# EAGLE design NEW LINE 十字左右 (EAGLE 9.6.2)

## Sheet 1 of 4

## Sheet 2 of 4
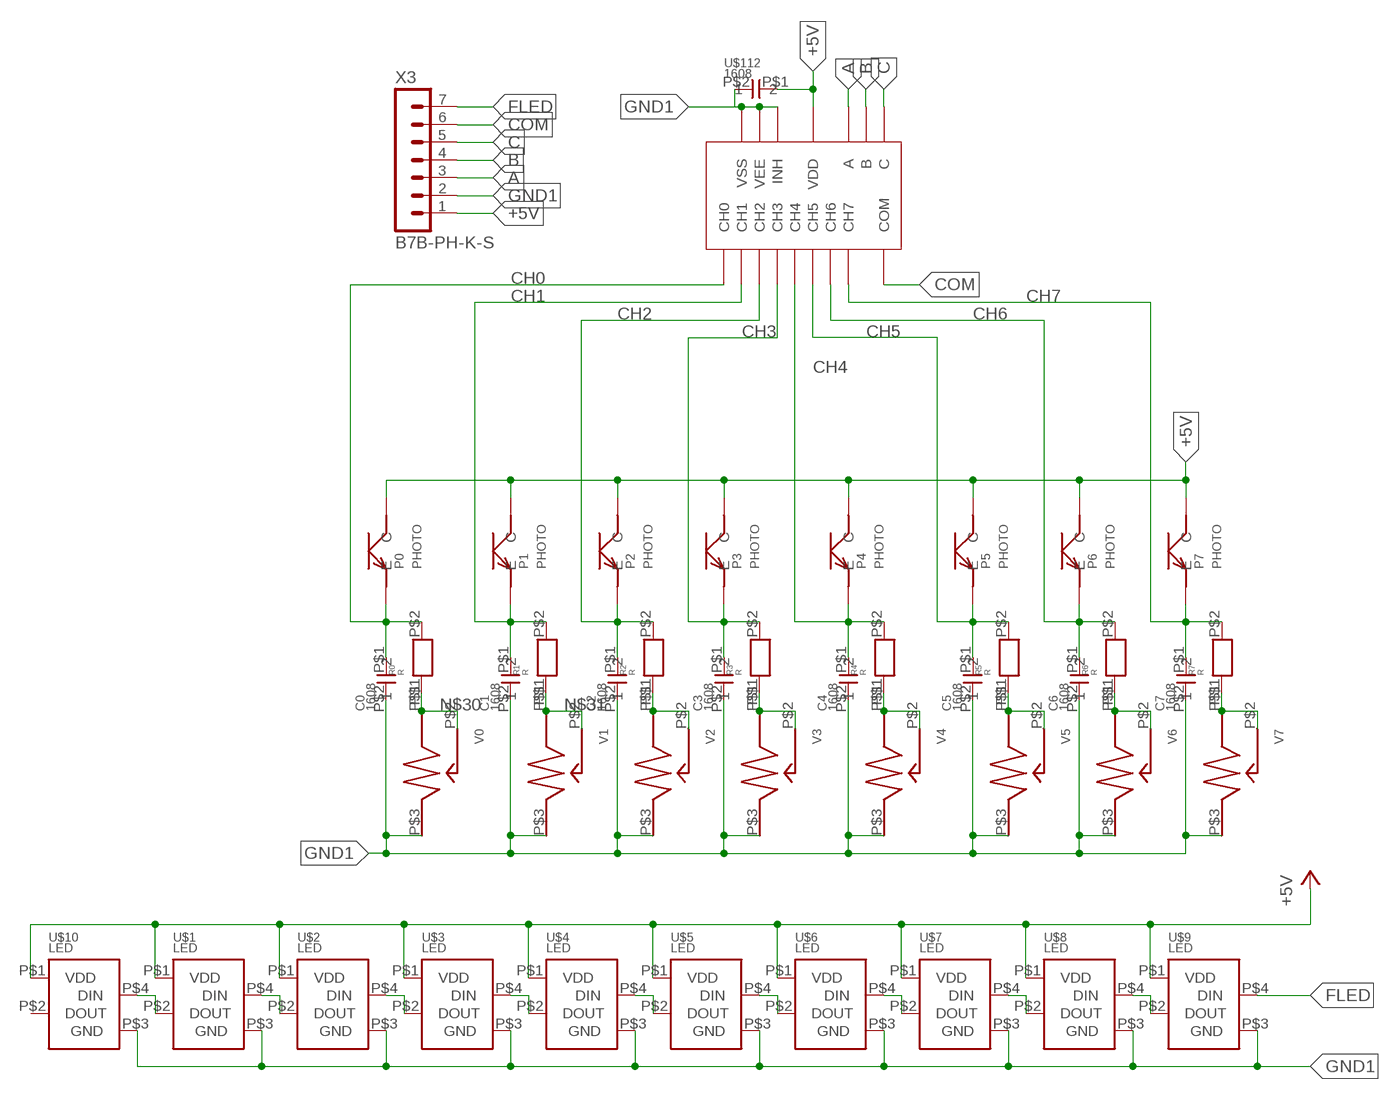
[diagram p0: schematic, sheet 2]

### Parts
C0  1608  [CON]
C1  1608  [CON]
C2  1608  [CON]
C3  1608  [CON]
C4  1608  [CON]
C5  1608  [CON]
C6  1608  [CON]
C7  1608  [CON]
P0  PHOTO  [PHOTO]
P1  PHOTO  [PHOTO]
P2  PHOTO  [PHOTO]
P3  PHOTO  [PHOTO]
P4  PHOTO  [PHOTO]
P5  PHOTO  [PHOTO]
P6  PHOTO  [PHOTO]
P7  PHOTO  [PHOTO]
R0  R  [1608]
R1  R  [1608]
R2  R  [1608]
R3  R  [1608]
R4  R  [1608]
R5  R  [1608]
R6  R  [1608]
R7  R  [1608]
U$1  LED  [LED]
U$2  LED  [LED]
U$3  LED  [LED]
U$4  LED  [LED]
U$5  LED  [LED]
U$6  LED  [LED]
U$7  LED  [LED]
U$8  LED  [LED]
U$9  LED  [LED]
U$10  LED  [LED]
U$79  AM  [SOP65P640X120-16N]
U$112  1608  [CON]
V0  VR  [VR]
V1  VR  [VR]
V2  VR  [VR]
V3  VR  [VR]
V4  VR  [VR]
V5  VR  [VR]
V6  VR  [VR]
V7  VR  [VR]
X3  B7B-PH-K-S  [B7B-PH-K-S]

### Nets
+5V: P0.P$1(C) P1.P$1(C) P2.P$1(C) P3.P$1(C) P4.P$1(C) P5.P$1(C) P6.P$1(C) P7.P$1(C) U$1.P$1(VDD) U$2.P$1(VDD) U$3.P$1(VDD) U$4.P$1(VDD) U$5.P$1(VDD) U$6.P$1(VDD) U$7.P$1(VDD) U$8.P$1(VDD) U$9.P$1(VDD) U$10.P$1(VDD) U$79.16(VDD) U$112.P$1 X3.1
A: U$79.11(A) X3.3
B: U$79.10(B) X3.4
C: U$79.9(C) X3.5
CH0: C0.P$1 P0.P$2(E) R0.P$2 U$79.13(CH0)
CH1: C1.P$1 P1.P$2(E) R1.P$2 U$79.14(CH1)
CH2: C2.P$1 P2.P$2(E) R2.P$2 U$79.15(CH2)
CH3: C3.P$1 P3.P$2(E) R3.P$2 U$79.12(CH3)
CH4: C4.P$1 P4.P$2(E) R4.P$2 U$79.1(CH4)
CH5: C5.P$1 P5.P$2(E) R5.P$2 U$79.5(CH5)
CH6: C6.P$1 P6.P$2(E) R6.P$2 U$79.2(CH6)
CH7: C7.P$1 P7.P$2(E) R7.P$2 U$79.4(CH7)
COM: U$79.3(COM) X3.6
FLED: U$9.P$4(DIN) X3.7
GND1: C0.P$2 C1.P$2 C2.P$2 C3.P$2 C4.P$2 C5.P$2 C6.P$2 C7.P$2 U$1.P$3(GND) U$2.P$3(GND) U$3.P$3(GND) U$4.P$3(GND) U$5.P$3(GND) U$6.P$3(GND) U$7.P$3(GND) U$8.P$3(GND) U$9.P$3(GND) U$10.P$3(GND) U$79.6(INH) U$79.7(VEE) U$79.8(VSS) U$112.P$2 V0.P$3 V1.P$3 V2.P$3 V3.P$3 V4.P$3 V5.P$3 V6.P$3 V7.P$3 X3.2
N$1: U$1.P$2(DOUT) U$10.P$4(DIN)
N$3: U$1.P$4(DIN) U$2.P$2(DOUT)
N$4: U$2.P$4(DIN) U$3.P$2(DOUT)
N$5: U$3.P$4(DIN) U$4.P$2(DOUT)
N$6: U$4.P$4(DIN) U$5.P$2(DOUT)
N$7: U$5.P$4(DIN) U$6.P$2(DOUT)
N$8: U$6.P$4(DIN) U$7.P$2(DOUT)
N$9: U$7.P$4(DIN) U$8.P$2(DOUT)
N$10: U$8.P$4(DIN) U$9.P$2(DOUT)
N$30: R0.P$1 V0.P$1 V0.P$2
N$31: R1.P$1 V1.P$1 V1.P$2
N$32: R2.P$1 V2.P$1 V2.P$2
N$33: R3.P$1 V3.P$1 V3.P$2
N$34: R4.P$1 V4.P$1 V4.P$2
N$35: R5.P$1 V5.P$1 V5.P$2
N$36: R6.P$1 V6.P$1 V6.P$2
N$37: R7.P$1 V7.P$1 V7.P$2
Unconnected: U$10.P$2(DOUT)

## Sheet 3 of 4

## Sheet 4 of 4

## Library data of the parts
C0 C1-C7 U$112 = con1608:1608
P0 P1-P7 = Chip phototransistor:PHOTO
R0 R1-R7 = R 1608:R
U$1-U$10 = フルカラーLED:LED
U$79 = アナログマルチプレクサ:AM
V0 V1-V7 = VR tippu:VR
X3 = con-JST PH:B7B-PH: JST PH series header 2.00mm pitch disconnectable crimp style connectors, vertical (side entry type), 7 pins

## Net classes
0 default: width 0.254 mm, clearance 0.076 mm

## Board
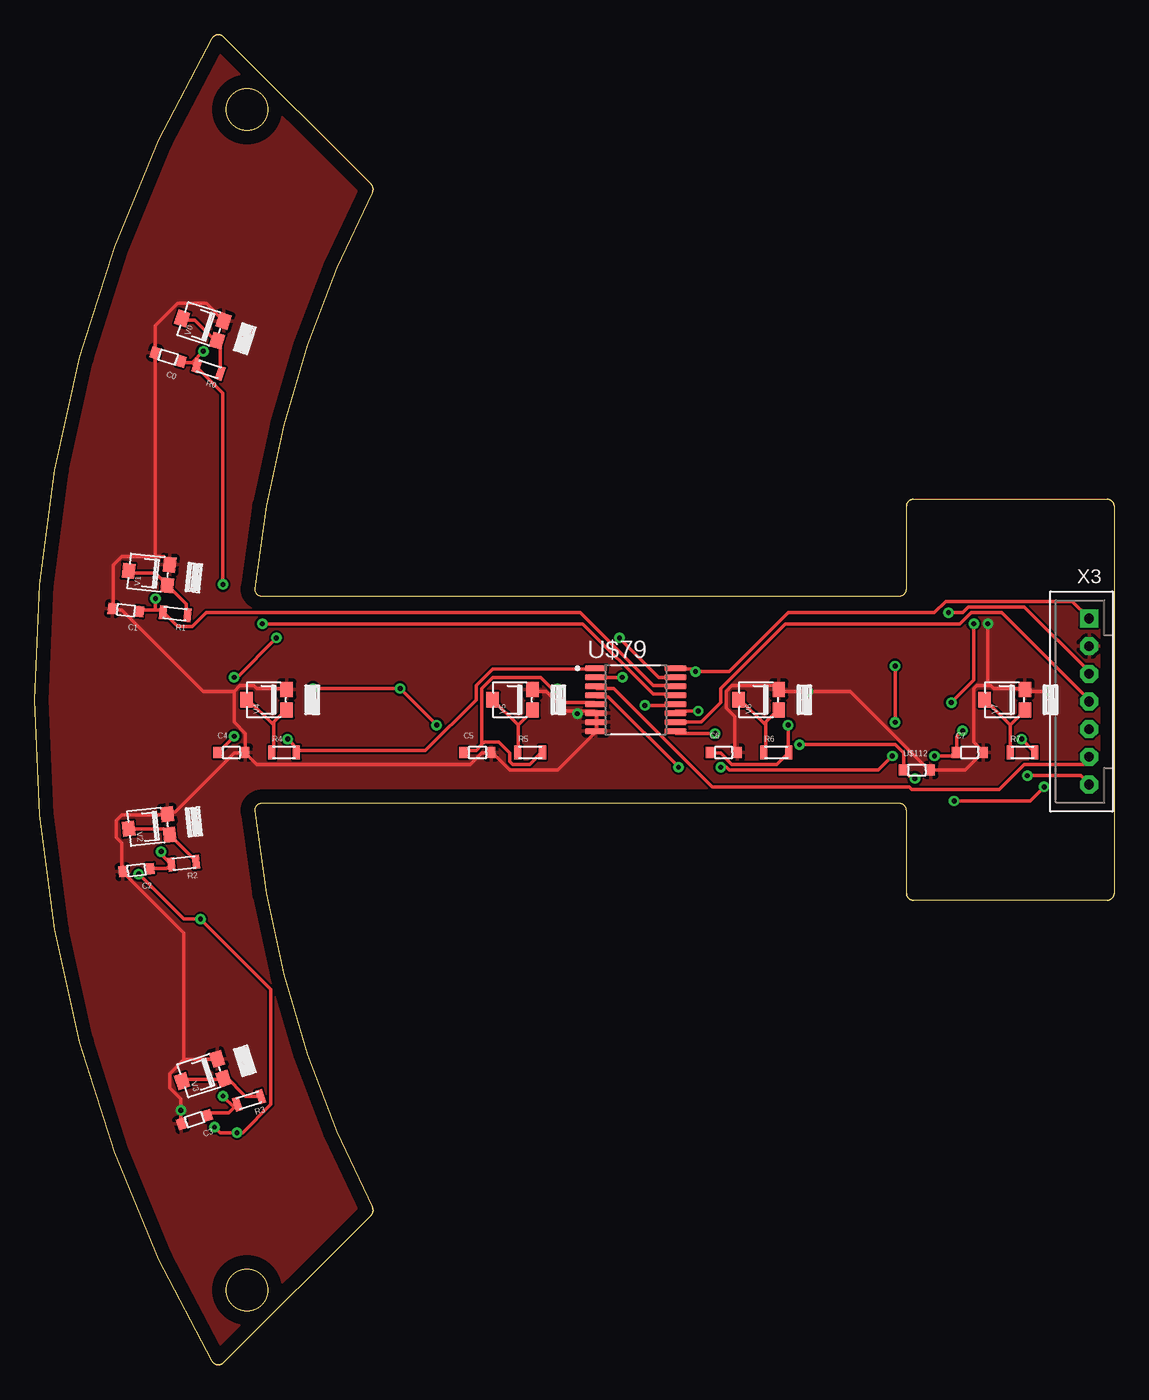
[diagram p1: board, top side]
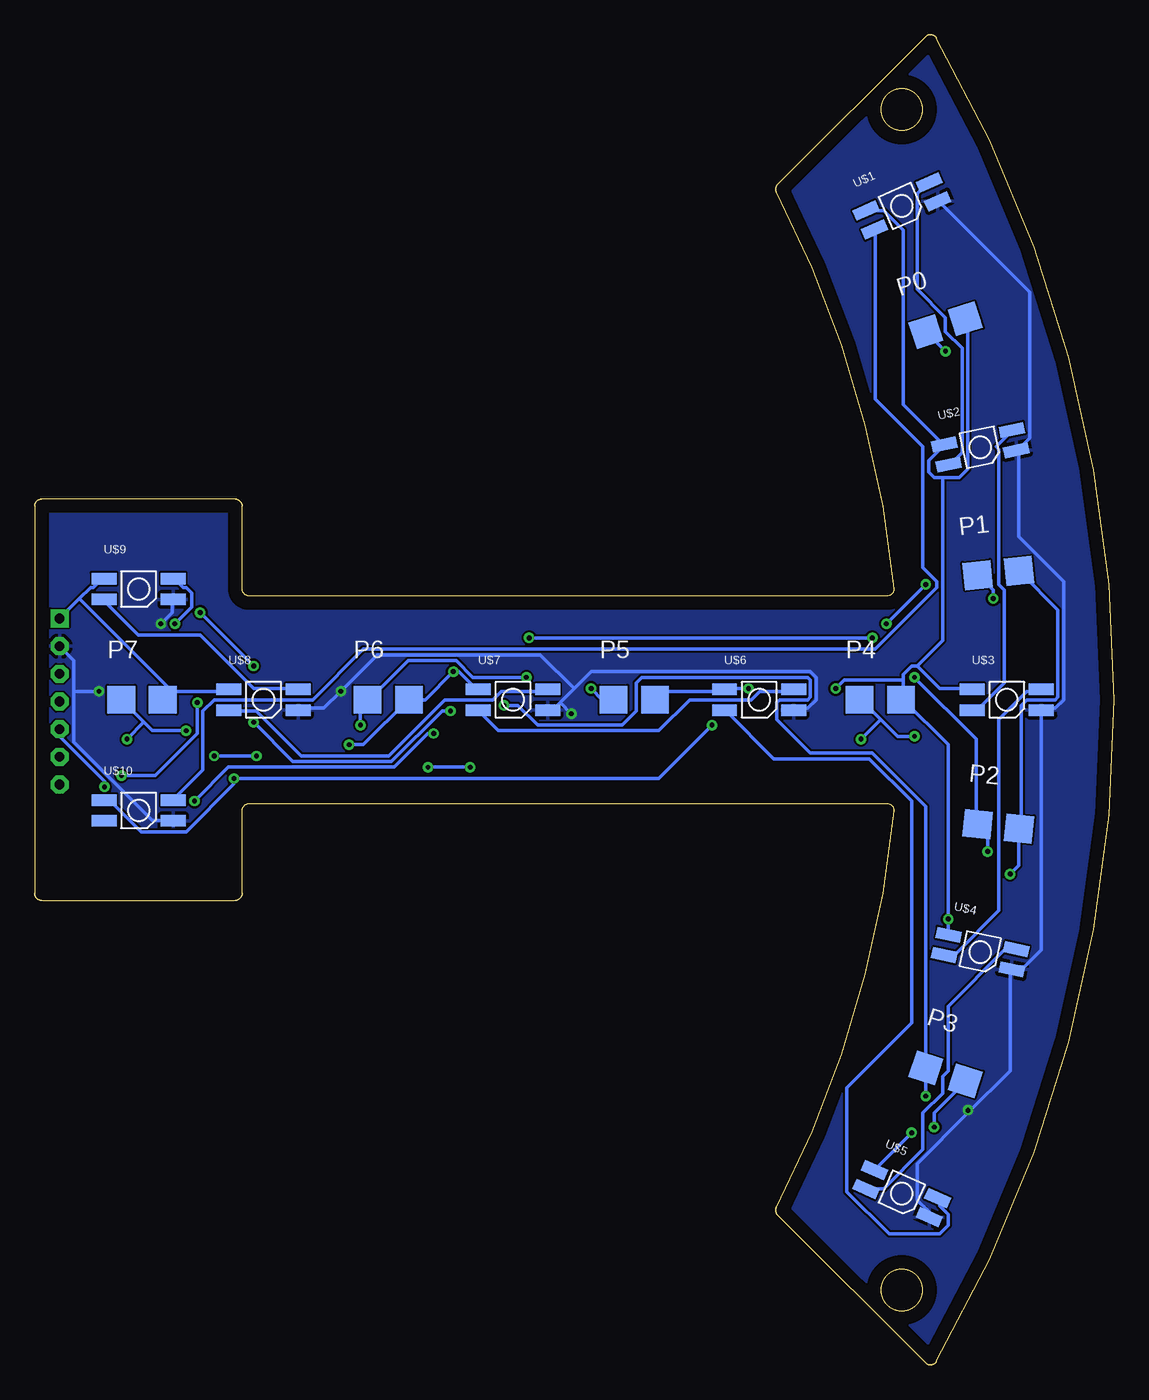
[diagram p2: board, bottom side, seen from below]

Size 78 x 96.16 mm. Coordinates in mm from the lower left corner, seen from the top.
Outline: 12.84,0.25 arc105 13.63,0.15
Outline: 24.31,10.83 arc72 24.4,11.41
Outline: 16.4,40.58 arc96 15.91,40.03
Outline: 63,40.08 arc90 62.5,40.58
Outline: 63,34.08 arc90 63.5,33.58
Outline: 77.5,33.58 arc90 78,34.08
Outline: 78,62.08 arc90 77.5,62.58
Outline: 63.5,62.58 arc90 63,62.08
Outline: 62.5,55.58 arc90 63,56.08
Outline: 15.91,56.13 arc96 16.4,55.58
Outline: 24.4,84.75 arc72 24.31,85.33
Outline: 13.63,96.01 arc105 12.84,95.91
Outline: 13.63,0.15 arc-105 12.84,0.25
Outline: 12.84,0.25 arc-60 12.84,95.91
Outline: 12.84,95.91 arc-105 13.63,96.01
Outline: 13.63,96.01 24.31,85.33
Outline: 24.31,85.33 arc-72 24.4,84.75
Outline: 24.4,84.75 arc22 15.91,56.13
Outline: 15.91,56.13 arc96 16.4,55.58
Outline: 16.4,55.58 62.5,55.58
Outline: 62.5,55.58 arc90 63,56.08
Outline: 63,56.08 63,62.08
Outline: 63,62.08 arc-90 63.5,62.58
Outline: 63.5,62.58 77.5,62.58
Outline: 77.5,62.58 arc-90 78,62.08
Outline: 78,62.08 78,34.08
Outline: 78,34.08 arc-90 77.5,33.58
Outline: 77.5,33.58 63.5,33.58
Outline: 63.5,33.58 arc-90 63,34.08
Outline: 63,34.08 63,40.08
Outline: 63,40.08 arc90 62.5,40.58
Outline: 62.5,40.58 16.4,40.58
Outline: 16.4,40.58 arc96 15.91,40.03
Outline: 15.91,40.03 arc22 24.4,11.41
Outline: 24.4,11.41 arc-72 24.31,10.83
Outline: 24.31,10.83 13.63,0.15
Outline: circle at 15.35,5.4 radius 1.5
Outline: circle at 15.35,90.75 radius 1.5
Outline: circle at 15.35,90.75 radius 1.5
Outline: circle at 15.35,5.4 radius 1.5
Outline: circle at 15.35,90.75 radius 1.5
Outline: circle at 15.35,5.4 radius 1.5
Copper layers (1*16): Top 0.035mm / dielectric 1.5mm / Bottom 0.035mm
Design rules "default": minimum track width 6mil, minimum drill 0.35mm, track to track 6mil, track to pad 6mil, pad to pad 6mil, via to via 6mil, smd to smd 6mil, copper to edge 40mil, drill to drill 6mil, minimum pad ring 10mil, minimum via ring 8mil, stop-mask expansion 4mil, vias tented up to drill 0mil, thermal gap 10mil

### Footprints (pad centres in the part's own frame; a part is rotated, then mirrored left to right if it is on the bottom)
CON = smd 0.6 x 0.813: P$1 -1,0; P$2 1,0
PHOTO = smd 2 x 2 bottom: P$1 -1.365,0; P$2 1.635,0
1608 = smd 0.508 x 1.016: P$1 -0.889,0; P$2 0.889,0
LED = smd 1.8 x 0.82: P$1 -2.5,0.75; P$2 -2.5,-0.75; P$3 2.5,-0.75; P$4 2.5,0.75
SOP65P640X120-16N = smd 1.57 x 0.41: 1 -2.87,2.275; 2 -2.87,1.625; 3 -2.87,0.975; 4 -2.87,0.325; 5 -2.87,-0.325; 6 -2.87,-0.975; 7 -2.87,-1.625; 8 -2.87,-2.275; 9 2.87,-2.275; 10 2.87,-1.625; 11 2.87,-0.975; 12 2.87,-0.325; 13 2.87,0.325; 14 2.87,0.975; 15 2.87,1.625; 16 2.87,2.275
VR = smd 1.1 x 0.9: P$1 0,1.45; P$2 -0.75,-1.45; P$3 0.75,-1.45
B7B-PH-K-S = drill 0.7 pad 1.3 square: 1 6,0 | drill 0.7 pad 1.3 octagon: 2 4,0; 3 2,0; 4 0,0; 5 -2,0; 6 -4,0; 7 -6,0

### Placement (x,y rotation side)
C0  9.65,72.84 162 top
C1  6.6,54.56 174 top
C2  7.36,35.76 186 top
C3  11.55,17.73 198 top
C4  14.22,44.27 0 top
C5  32,44.27 0 top
C6  49.78,44.27 0 top
C7  67.56,44.27 0 top
P0  12.04,75.19 342 top
P1  8.23,57.25 354 top
P2  8.23,38.91 6 top
P3  12.04,20.96 18 top
P4  16.76,48.08 0 top
P5  34.54,48.08 0 top
P6  52.32,48.08 0 top
P7  70.1,48.08 0 top
R0  12.57,71.95 162 top
R1  10.16,54.3 174 top
R2  10.79,36.27 186 top
R3  15.49,19.12 198 top
R4  18.03,44.27 0 top
R5  35.81,44.27 0 top
R6  53.59,44.27 0 top
R7  71.37,44.27 0 top
U$1  15.34,83.77 24 bottom
U$2  9.67,66.32 12 bottom
U$3  7.75,48.08 0 bottom
U$4  9.67,29.83 348 bottom
U$5  15.34,12.39 336 bottom
U$6  25.65,48.08 0 bottom
U$7  43.43,48.08 0 bottom
U$8  61.46,48.08 0 bottom
U$9  70.48,56.08 0 bottom
U$10  70.48,40.08 0 bottom
U$79  43.43,48.08 0 top
U$112  63.75,43 0 top
V0  12.04,75.19 72 top
V1  8.23,57.25 84 top
V2  8.23,38.91 96 top
V3  12.04,20.96 108 top
V4  16.76,48.08 90 top
V5  34.54,48.08 90 top
V6  52.32,48.08 90 top
V7  70.1,48.08 90 top
X3  76.2,47.95 90 top

### Tracks (layer width: path | path; a pad name or v marks a point on that pad's centre or on a via)
+5V  (via drill 0.35)
  Top 0.254: 62.79,43 63.39,42.39 v63.6,42.39 | U$79.16 46.33,50.31 47.55,50.31 v47.75,50.11 50.19,50.11 54.45,54.38 65.02,54.38 65.83,55.19 74.98,55.19 76.2,53.97 X3.1 | 62.79,43 62.79,44.22 62.18,44.83 v55.27,44.83 | 62.79,43 U$112.P$1 | v13,17.19 13.41,16.79 v14.63,16.79 15.03,16.79 17.07,18.82 17.07,27.15 v11.99,32.23 10.77,32.23 v7.51,35.48 | v20.11,48.89 v26.41,48.89 v29.05,46.25
  Bottom 0.254: U$10.P$1 72.95,40.76 72.54,40.76 70.3,38.53 67.05,38.53 63.6,41.98 v63.6,42.39 32.91,42.39 v29.05,46.25 | U$7.P$1 46.12,48.89 47.34,50.11 v47.75,50.11 49.78,48.08 P6.P$1 51,48.08 54.25,44.83 v55.27,44.83 | 68.07,48.69 64,48.69 U$8.P$1 | 68.07,48.69 68.68,48.08 P7.P$1 68.07,48.69 | 74.77,55.39 76.2,53.97 X3.1 | 74.77,55.39 73.96,56.21 73.76,56.21 73.15,56.82 U$9.P$1 | 74.77,55.39 68.07,48.69 | 12.39,64.13 11.17,64.13 10.56,64.74 10.56,75.51 P0.P$1 | 12.39,64.13 13,64.13 13.41,64.54 13.41,65.35 12.39,66.37 U$2.P$1 12.39,66.57 15.24,69.41 15.24,82.01 16.66,83.44 17.88,83.44 U$1.P$1 | P1.P$1 6.7,57.22 4.06,54.58 4.06,48.28 4.26,48.08 6.3,48.08 6.7,47.67 6.7,38.93 P2.P$1 6.91,38.73 6.91,36.09 v7.51,35.48 | v14.63,16.79 17.27,14.14 U$5.P$1 | v13,17.19 13,18.21 10.77,20.44 P3.P$1 | P5.P$1 33.12,48.08 32.51,48.69 28.24,48.69 U$6.P$1 28.04,48.89 v26.41,48.89 | 14.22,50.52 12.59,48.89 10.36,48.89 U$3.P$1 | 14.22,50.52 14.63,50.52 15.24,49.91 15.24,49.5 | 15.24,48.08 15.24,49.5 | 15.24,48.08 11.99,44.83 v11.99,32.23 11.99,31.21 U$4.P$1 | 15.24,48.08 P4.P$1 | v20.11,48.89 19.5,49.5 15.24,49.5 | 12.39,64.13 12.39,52.35 14.22,50.52
A  (via drill 0.35)
  Top 0.254: v47.95,47.27 46.33,47.27 U$79.11 | v62.18,50.52 v62.18,46.45 | v66.04,54.38 67.05,54.38 67.46,54.78 71.52,54.78 76.2,50.11 X3.3
  Bottom 0.254: v47.95,47.27 48.56,47.27 52.22,43.61 59.33,43.61 v62.18,46.45 | v66.04,54.38 v62.18,50.52
B
  Top 0.254: U$79.10 46.33,46.45 48.15,46.45 49.58,47.88 49.58,48.89 54.25,53.56 66.85,53.56 67.66,54.38 69.9,54.38 76.2,48.08 X3.4
C  (via drill 0.35)
  Top 0.254: v49.17,45.64 46.33,45.64 U$79.9 | v66.44,40.76 71.93,40.76 v72.95,41.78
  Bottom 0.254: v49.17,45.64 49.58,45.64 52.02,43.2 64,43.2 v66.44,40.76 | v72.95,41.78 72.95,42.19 76.2,45.44 X3.5
CH0  (via drill 0.35)
  Top 0.254: 11.38,72.46 10.77,72.46 C0.P$1 | 11.38,72.46 11.58,72.26 R0.P$2 11.78,72.06 13.61,70.23 v13.61,56.41 | v12.19,73.28 11.38,72.46 | v16.46,53.56 39.62,53.56 44.7,48.48 46.12,48.48 U$79.13
  Bottom 0.254: v12.19,73.28 13.41,74.49 P0.P$2 | v13.61,56.41 v16.46,53.56
CH1  (via drill 0.35)
  Top 0.254: 8.73,54.58 9.14,54.58 R1.P$2 9.34,54.38 10.36,53.36 11.38,53.36 12.39,54.38 39.42,54.38 44.7,49.09 46.12,49.09 U$79.14 | 8.73,54.58 7.72,54.58 C1.P$1 | v8.73,55.39 8.73,54.58
  Bottom 0.254: v8.73,55.39 8.73,56 9.75,57.02 P1.P$2
CH2  (via drill 0.35)
  Top 0.254: C2.P$1 8.53,35.89 9.55,35.89 9.75,36.09 R2.P$2 9.75,36.29 9.14,36.9 v9.14,37.11 | v42.26,52.55 45.11,49.7 46.12,49.7 U$79.15 | v17.47,52.55 14.63,49.7 v14.42,49.7
  Bottom 0.254: v9.14,37.11 9.14,38.32 9.75,38.93 P2.P$2 9.95,39.14 9.95,45.23 v14.42,49.7 | v17.47,52.55 v42.26,52.55
CH3  (via drill 0.35)
  Top 0.254: 14.42,18.61 14.63,18.82 R3.P$2 | 14.42,18.61 14.02,18.21 12.59,18.21 C3.P$1 | v44.09,47.67 46.12,47.67 U$79.12 | v13.61,19.43 14.42,18.61
  Bottom 0.254: v44.09,47.67 43.07,47.67 41.65,46.25 35.56,46.25 34.54,47.27 34.54,49.3 34.13,49.7 22.15,49.7 21.94,49.5 21.94,48.28 22.15,48.08 24.18,48.08 24.38,47.88 24.38,46.66 21.94,44.22 17.47,44.22 13.61,40.36 13.61,21.66 P3.P$2 v13.61,19.43
CH4  (via drill 0.35)
  Top 0.254: v14.42,45.44 13.41,44.42 C4.P$1 | 19.1,44.42 28.24,44.42 31.9,48.08 31.9,49.09 33.12,50.31 40.43,50.31 U$79.1 | 19.1,44.42 v18.28,45.23 | 19.1,44.42 R4.P$2
  Bottom 0.254: v14.42,45.44 15.64,45.44 16.86,46.66 | 16.86,46.66 18.28,48.08 P4.P$2 | v18.28,45.23 16.86,46.66
CH5  (via drill 0.35)
  Top 0.254: 32.31,44.83 32.51,45.03 33.52,45.03 34.34,44.22 34.34,43.61 34.54,43.4 35.76,43.4 36.57,44.22 R5.P$2 | 32.31,44.83 31.9,44.42 31.09,44.42 C5.P$1 | 37.59,48.69 36.57,49.7 33.12,49.7 32.31,48.89 32.31,44.83 | 37.59,48.69 38.4,47.88 40.43,47.88 U$79.5 | 37.59,48.69 v37.79,48.89
  Bottom 0.254: P5.P$2 36.98,48.08 v37.79,48.89
CH6  (via drill 0.35)
  Top 0.254: C6.P$1 48.97,44.22 49.58,44.22 50.39,43.4 53.64,43.4 54.45,44.22 R6.P$2 54.45,44.42 v54.45,46.25 | v42.47,49.7 40.64,49.7 U$79.2
  Bottom 0.254: v42.47,49.7 46.33,49.7 47.55,50.92 51,50.92 53.84,48.08 P6.P$2 54.05,48.08 54.45,47.67 v54.45,46.25
CH7  (via drill 0.35)
  Top 0.254: v67.05,45.84 66.65,45.44 66.65,44.42 C7.P$1 66.44,44.22 66.24,44.01 v65.02,44.01 | v71.32,45.23 72.13,44.42 R7.P$2 | v46.53,43.2 41.45,48.28 40.64,48.28 U$79.4 | v49.58,43.2 49.98,43.2 50.19,43 60.96,43 v61.97,44.01
  Bottom 0.254: v67.05,45.84 69.49,45.84 70.1,46.45 | 70.1,46.45 71.73,48.08 P7.P$2 | 70.1,46.45 v71.32,45.23 | v49.58,43.2 v46.53,43.2 | v65.02,44.01 v61.97,44.01
COM
  Top 0.254: U$79.3 40.64,48.89 41.86,48.89 48.97,41.78 63.19,41.78 63.39,41.58 69.69,41.58 71.52,43.4 75.79,43.4 76.2,43.81 X3.6
FLED  (via drill 0.35)
  Top 0.254: v67.87,53.56 67.87,49.5 v66.24,47.88 | v71.73,42.59 75.59,42.59 76.2,41.98 X3.7
  Bottom 0.254: v67.87,53.56 66.65,54.78 66.65,55.8 67.05,56.21 67.26,56.21 67.87,56.82 U$9.P$4 | v66.24,47.88 66.24,45.64 69.29,42.59 v71.73,42.59
GND1  (via drill 0.35)
  Top 0.254: C6.P$2 50.59,44.42 50.59,46.86 49.98,47.47 49.98,48.69 50.39,49.09 53.44,49.09 53.64,48.89 V6.P$3 53.84,48.69 v55.88,48.69 58.92,48.69 64.61,43 U$112.P$2 67.26,43 68.47,44.22 C7.P$2 68.47,44.42 67.87,45.03 67.87,48.89 68.07,49.09 68.88,49.09 | 68.88,49.09 69.08,49.09 69.29,48.89 71.52,48.89 V7.P$3 71.73,48.69 v73.35,48.69 | 68.88,49.09 v68.88,53.56 | 39.21,47.27 40.43,47.27 U$79.6 40.64,47.06 40.64,46.66 U$79.7 40.64,46.45 40.64,45.84 U$79.8 40.43,45.64 37.79,43 34.34,43 33.12,44.22 C5.P$2 32.91,44.22 32.31,44.22 31.49,43.4 16.05,43.4 15.24,44.22 C4.P$2 | 39.21,47.27 38.4,47.27 36.98,48.69 36.17,48.69 V5.P$3 | V0.P$3 13.61,75.51 12.39,76.73 10.36,76.73 8.73,75.1 8.73,73.28 C0.P$2 8.73,73.07 8.73,58.44 | 10.77,22.07 9.75,21.05 9.75,20.04 10.56,19.22 v10.56,18.41 10.56,17.6 C3.P$2 | 10.77,22.07 13,22.07 V3.P$3 | 8.73,58.44 9.34,58.44 9.75,58.04 V1.P$3 | 8.73,58.44 6.3,58.44 5.69,57.83 5.69,54.78 C1.P$2 5.69,54.58 6.3,54.58 12.19,48.69 14.42,48.69 | C4.P$2 15.03,44.22 14.42,44.22 10.16,39.95 9.75,39.95 V2.P$3 9.55,39.75 6.3,39.75 5.89,39.34 5.89,38.12 6.3,37.72 6.3,35.68 C2.P$2 6.5,35.48 10.77,31.21 10.77,22.07 | 14.42,48.69 14.83,49.09 15.85,49.09 16.05,48.89 18.08,48.89 V4.P$3 | 14.42,48.69 14.42,46.45 15.24,45.64 15.24,44.42 C4.P$2 | 39.21,47.27 v39.21,47.06
  Bottom 0.254: U$1.P$3 12.59,84.04 6.09,77.54 6.09,66.98 6.91,66.16 U$2.P$3 6.91,65.96 6.91,59.86 3.65,56.61 3.65,48.08 4.26,47.47 5.08,47.47 U$3.P$3 5.28,47.27 5.28,29.99 6.5,28.77 7.31,28.77 U$4.P$3 7.51,28.57 7.51,21.26 10.56,18.21 | 10.56,18.21 14.22,14.55 14.22,11.91 13.41,11.1 13.41,10.69 U$5.P$3 | 40.03,47.88 40.43,47.47 40.84,47.47 U$7.P$3 | 40.03,47.88 39.01,48.89 | 39.01,48.89 37.79,50.11 21.94,50.11 21.54,49.7 21.54,48.08 22.15,47.47 22.96,47.47 U$6.P$3 | 39.01,48.89 41.45,51.33 53.23,51.33 v55.88,48.69 57.1,47.47 58.92,47.47 U$8.P$3 | 75.18,48.69 75.18,50.92 X3.2 | 75.18,48.69 75.18,45.03 69.49,39.34 68.07,39.34 U$10.P$3 | v68.88,53.56 68.07,54.38 68.07,55.19 U$9.P$3 | v73.35,48.69 75.18,48.69 | v39.21,47.06 40.03,47.88 | v10.56,18.41 10.56,18.21
  pour Top: -14.99,106.5 -14.99,-7.8 90.42,-7.8 90.42,111.58 -14.99,111.58
  pour Bottom: -8.64,106.5 -8.64,-2.72 -9.91,-3.99 86.61,-3.99 86.61,101.42 84.07,103.96 -6.1,103.96
N$1
  Bottom 0.254: U$1.P$2 17.27,82.01 17.27,69.82 13.81,66.37 13.81,57.63 12.8,56.61 12.8,56.21 17.27,51.74 54.25,51.74 57.91,48.08 65.02,48.08 65.83,47.27 65.83,43 67.87,40.97 U$10.P$4
N$3
  Bottom 0.254: U$2.P$2 11.78,65.15 10.97,65.96 10.97,73.48 12.19,74.7 12.19,75.71 14.22,77.75 14.22,84.65 13.41,85.47 U$1.P$4
N$4
  Bottom 0.254: U$3.P$2 10.16,47.47 9.75,47.47 7.92,49.3 7.92,56 8.33,56.41 8.33,66.16 8.53,66.37 7.51,67.38 U$2.P$4
N$5
  Bottom 0.254: U$4.P$2 12.19,29.79 11.38,29.79 8.33,32.84 8.33,46.66 6.3,48.69 5.28,48.69 U$3.P$4
N$6
  Bottom 0.254: U$5.P$2 17.88,12.72 16.66,12.72 13.81,15.57 13.81,18.21 12.39,19.63 12.39,20.85 11.99,21.26 11.99,25.93 7.92,29.99 7.11,29.99 U$4.P$4
N$7
  Bottom 0.254: U$5.P$4 12.59,11.91 12.59,11.5 11.99,10.89 11.99,10.08 12.59,9.47 16.25,9.47 19.3,12.52 19.3,20.04 14.63,24.71 14.63,40.76 17.67,43.81 24.58,43.81 28.04,47.27 U$6.P$2
N$8
  Bottom 0.254: U$6.P$4 23.16,48.69 25.6,48.69 26.21,48.08 30.68,48.08 32.91,45.84 44.5,45.84 45.92,47.27 U$7.P$2
N$9
  Bottom 0.254: U$7.P$4 41.04,48.69 44.29,48.69 44.9,48.08 48.36,48.08 52.42,44.01 58.72,44.01 61.97,47.27 63.8,47.27 U$8.P$2
N$10
  Bottom 0.254: U$8.P$4 59.13,48.89 62.18,48.89 66.04,52.75 70.51,52.75 72.95,55.19 U$9.P$2
N$30
  Top 0.254: R0.P$1 13.41,71.85 13.41,73.68 13.2,73.88 V0.P$2 13,74.09 11.58,75.51 10.77,75.51 V0.P$1
N$31
  Top 0.254: R1.P$1 10.97,54.38 10.97,54.99 9.75,56.21 V1.P$2 9.55,56.41 8.73,57.22 6.91,57.22 V1.P$1
N$32
  Top 0.254: R2.P$1 11.58,36.5 9.95,38.12 V2.P$2 9.75,38.32 9.34,38.73 6.91,38.73 V2.P$1
N$33
  Top 0.254: R3.P$1 16.25,19.43 15.24,19.43 13.81,20.85 V3.P$2 13.61,20.65 10.77,20.65 V3.P$1
N$34
  Top 0.254: 17.27,46.25 17.27,46.45 18.08,47.27 V4.P$2 | 17.27,46.25 17.27,44.42 R4.P$1 | 17.27,46.25 15.44,48.08 V4.P$1
N$35
  Top 0.254: 34.95,46.25 34.95,44.42 R5.P$1 | 34.95,46.25 35.96,47.27 V5.P$2 | 34.95,46.25 33.12,48.08 V5.P$1
N$36
  Top 0.254: 52.83,46.25 52.83,46.45 53.64,47.27 V6.P$2 | 52.83,46.25 52.83,44.42 R6.P$1 | 52.83,46.25 51,48.08 V6.P$1
N$37
  Top 0.254: 70.51,46.25 70.51,44.42 R7.P$1 | 70.51,46.25 71.52,47.27 V7.P$2 | 70.51,46.25 68.68,48.08 V7.P$1